# EAGLE design orb-se (EAGLE 6.5.0)
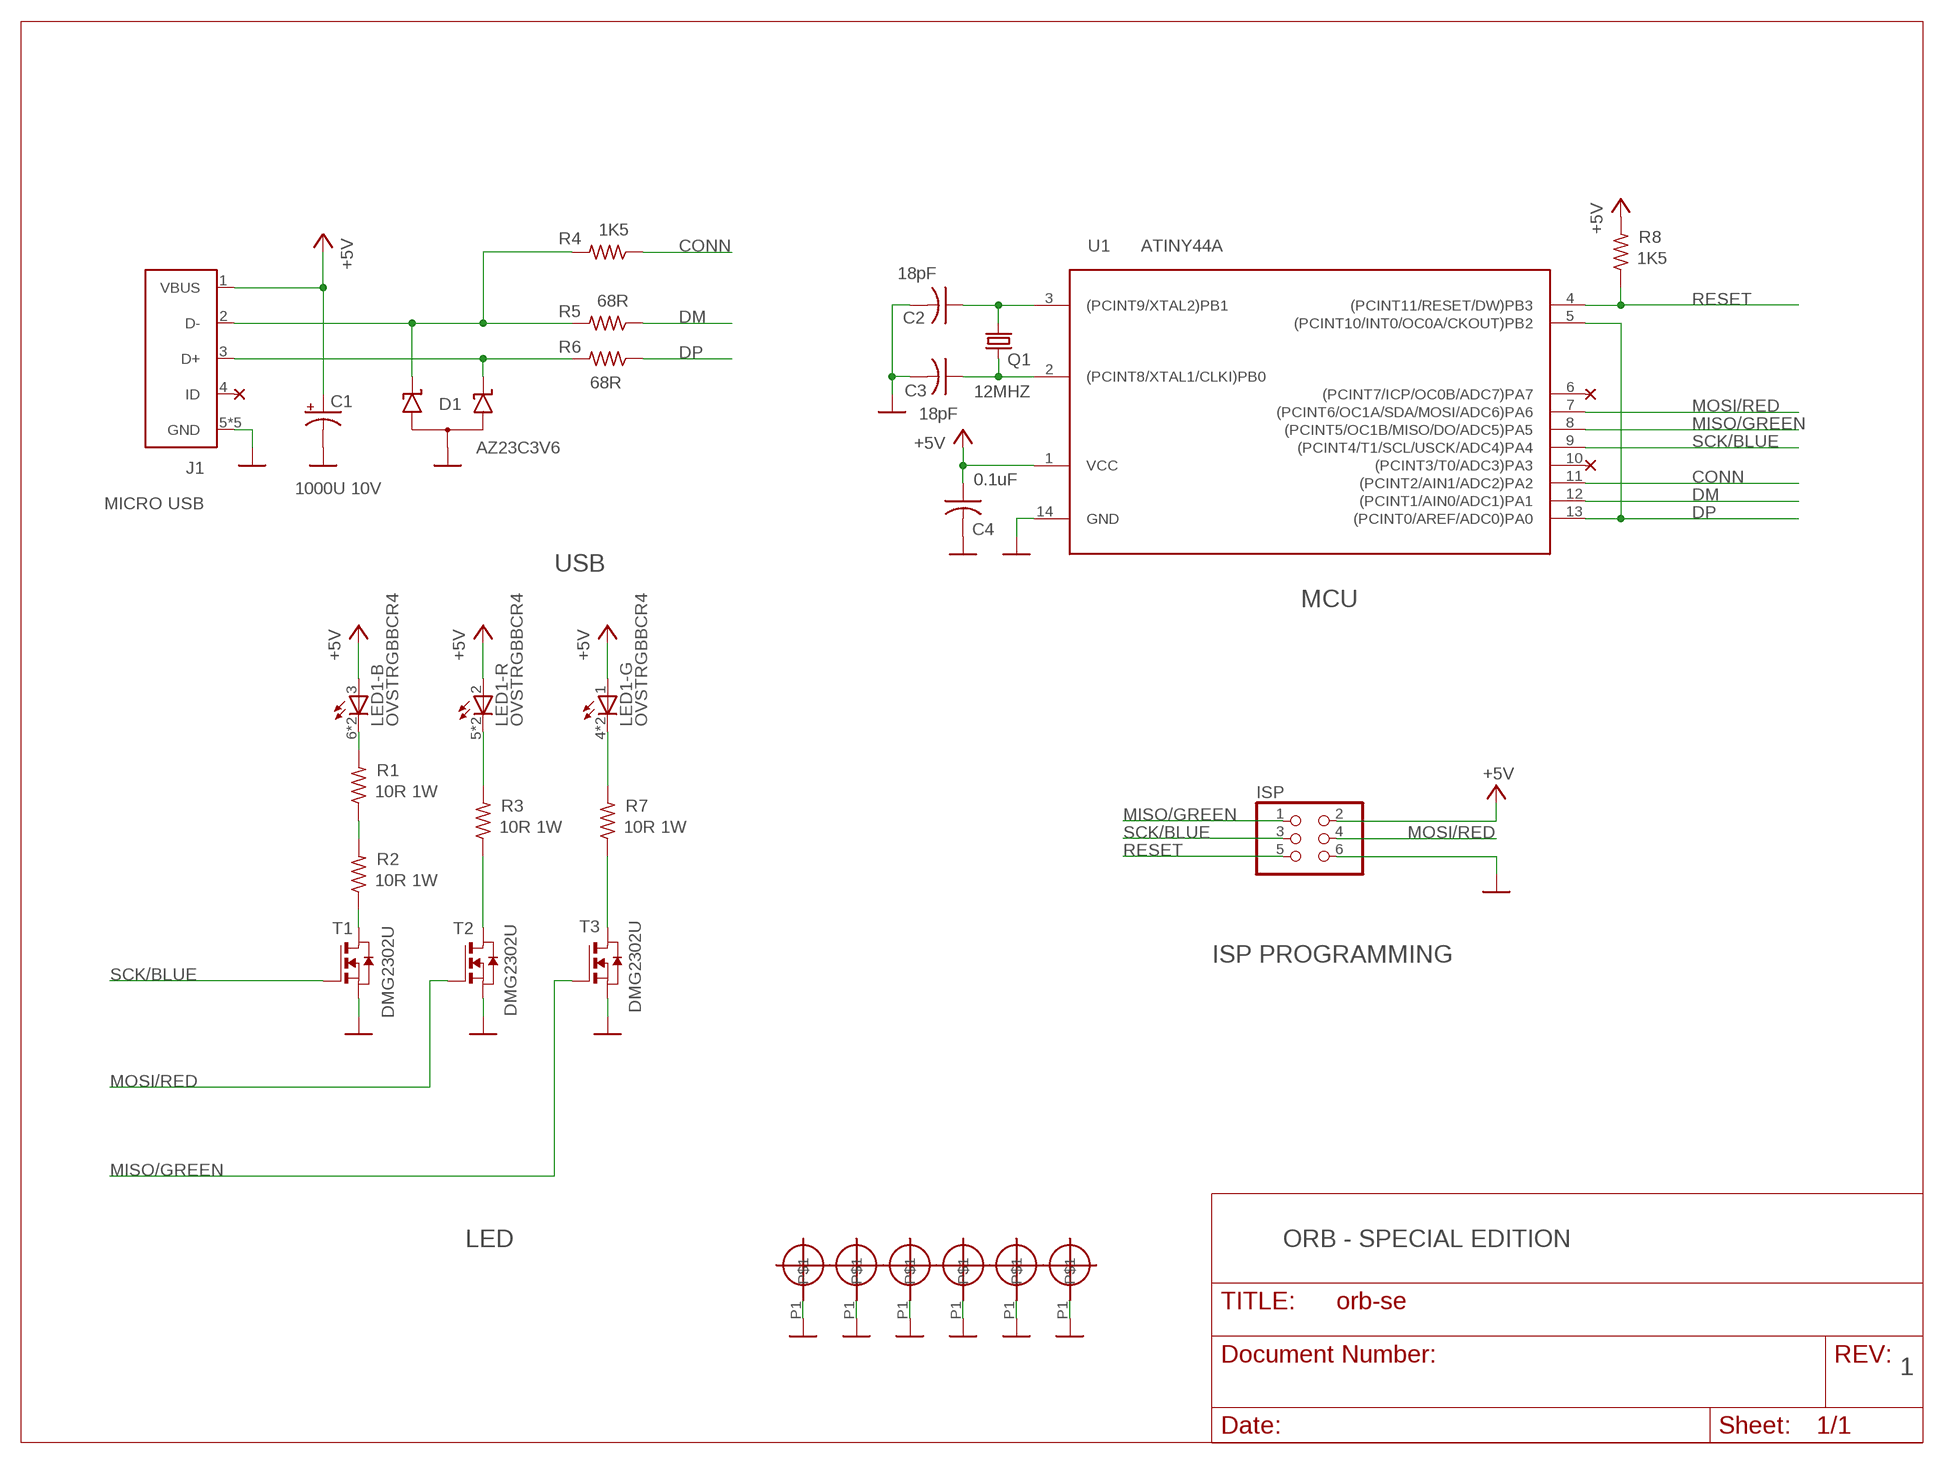
[diagram p0: schematic, sheet 1]

## Parts
C1  1000U 10V  CPOL-US153CLV-1010  [153CLV-1010]
C2  18pF  C-USC0805  [C0805]
C3  18pF  C-USC0805  [C0805]
C4  0.1uF  C-USC0805  [C0805]
D1  AZ23C3V6  [SOT23]
ISP  PINHD-2X3  [2X03]
J1  MICRO USB  USB  [USB-MICRO]
LED1  OVSTRGBBCR4  [OVSTRGBBCR4]
MH$1  MOUNTING_HOLE  [MOUNTING_HOLE]
MH$2  MOUNTING_HOLE  [MOUNTING_HOLE]
MH$3  MOUNTING_HOLE  [MOUNTING_HOLE]
MH$4  MOUNTING_HOLE  [MOUNTING_HOLE]
MH$5  MOUNTING_HOLE  [MOUNTING_HOLE]
MH$6  MOUNTING_HOLE  [MOUNTING_HOLE]
Q1  12MHZ  CRYSTAL  [CRYSTAL]
R1  10R 1W  R-US_R2512W  [R2512W]
R2  10R 1W  R-US_R2512W  [R2512W]
R3  10R 1W  R-US_R2512W  [R2512W]
R4  1K5  R-US_R0805  [R0805]
R5  68R  R-US_R0805  [R0805]
R6  68R  R-US_R0805  [R0805]
R7  10R 1W  R-US_R2512W  [R2512W]
R8  1K5  R-US_R0805  [R0805]
T1  DMG2302U  NMOSSOT23  [SOT-23]
T2  DMG2302U  NMOSSOT23  [SOT-23]
T3  DMG2302U  NMOSSOT23  [SOT-23]
U1  ATINY44A  TINY24/44/84-SSU  [SOIC14]

## Nets
+5V: C1.+ C4.1 ISP.2 J1.1(VBUS) LED1.1(-G:A) LED1.2(-R:A) LED1.3(-B:A) R8.2 U1.1(VCC)
CONN: R4.1 U1.11((PCINT2/AIN1/ADC2)PA2)
DM: R5.1 U1.12((PCINT1/AIN0/ADC1)PA1)
DP: R6.1 U1.5((PCINT10/INT0/OC0A/CKOUT)PB2) U1.13((PCINT0/AREF/ADC0)PA0)
GND: C1.- C2.2 C3.2 C4.2 D1.3(AA) ISP.6 J1.5(GND) J1.G1(GND) J1.G2(GND) J1.G3(GND) J1.G4(GND) MH$1.P1 MH$2.P1 MH$3.P1 MH$4.P1 MH$5.P1 MH$6.P1 T1.2(S) T2.2(S) T3.2(S) U1.14(GND) ; supply symbol labelled AZ23C3V6
MISO/GREEN: ISP.1 T3.3(G) U1.8((PCINT5/OC1B/MISO/DO/ADC5)PA5)
MOSI/RED: ISP.4 T2.3(G) U1.7((PCINT6/OC1A/SDA/MOSI/ADC6)PA6)
N$1: C2.1 Q1.2 U1.3((PCINT9/XTAL2)PB1)
N$3: C3.1 Q1.1 U1.2((PCINT8/XTAL1/CLKI)PB0)
N$4: R1.1 R2.2
N$5: D1.1(K1) J1.2(D-) R4.2 R5.2
N$6: D1.2(K2) J1.3(D+) R6.2
N$7: LED1.6(-B:C) LED1.6@1(-B:C) R1.2
N$8: LED1.5(-R:C) LED1.5@1(-R:C) R3.2
N$9: LED1.4(-G:C) LED1.4@1(-G:C) R7.2
N$13: R2.1 T1.1(D)
N$14: R3.1 T2.1(D)
N$15: R7.1 T3.1(D)
RESET: ISP.5 R8.1 U1.4((PCINT11/RESET/DW)PB3)
SCK/BLUE: ISP.3 T1.3(G) U1.9((PCINT4/T1/SCL/USCK/ADC4)PA4)
Unconnected: J1.4(ID) U1.6((PCINT7/ICP/OC0B/ADC7)PA7) U1.10((PCINT3/T0/ADC3)PA3)

## Notes on the sheet
- USB
- MCU
- ISP PROGRAMMING
- LED | ORB - SPECIAL EDITION
- 1

## Library data of the parts
C1 = orb-se:CPOL-US: POLARIZED CAPACITOR, American symbol
C2-C4 = orb-se:C-US: CAPACITOR, American symbol
D1 = orb-se:AZ23C3V6: Silicon Schottky Diodes General-purpose diode for high-speed switching
ISP = orb-se:PINHD-2X3
J1 = orb-se:USB
LED1 = orb-se:OVSTRGBBCR4: Full Color PLCC6 LED OVSTRGBBCR8 Source: www.optekinc.com .. ovstrgbbcr8.pdf
MH$1-MH$6 = orb-se:MOUNTING_HOLE
Q1 = orb-se:CRYSTAL: SMD CRYSTAL Source: www.ecsxtal.com .. Crystal 3.6864MHz CSM_7X_DU.PDF; OC_FARNELL: unknown; OC_NEWARK: unknown
R1-R8 = orb-se:R-US_: RESISTOR, American symbol
T1-T3 = orb-se:NMOSSOT23: MOS FET; OC_FARNELL: unknown; OC_NEWARK: unknown
U1 = orb-se:TINY24/44/84

## Net classes
1 power: width 0.254 mm

## Board
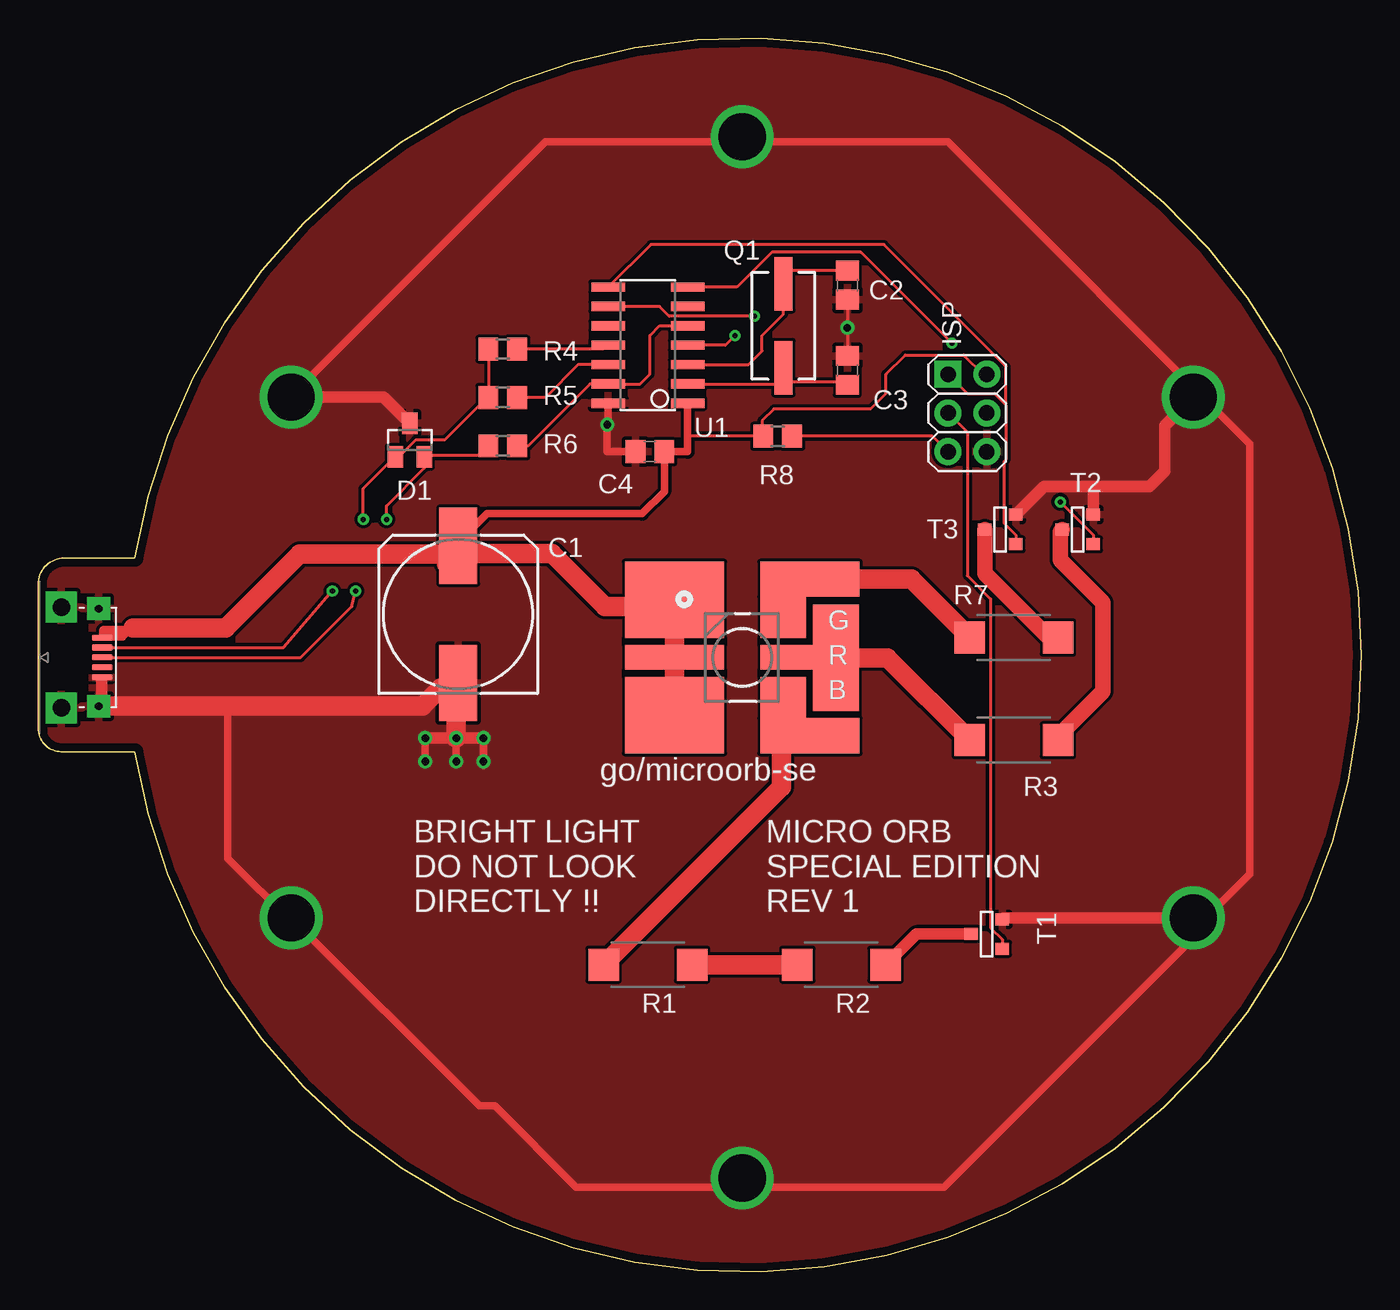
[diagram p1: board, top side]
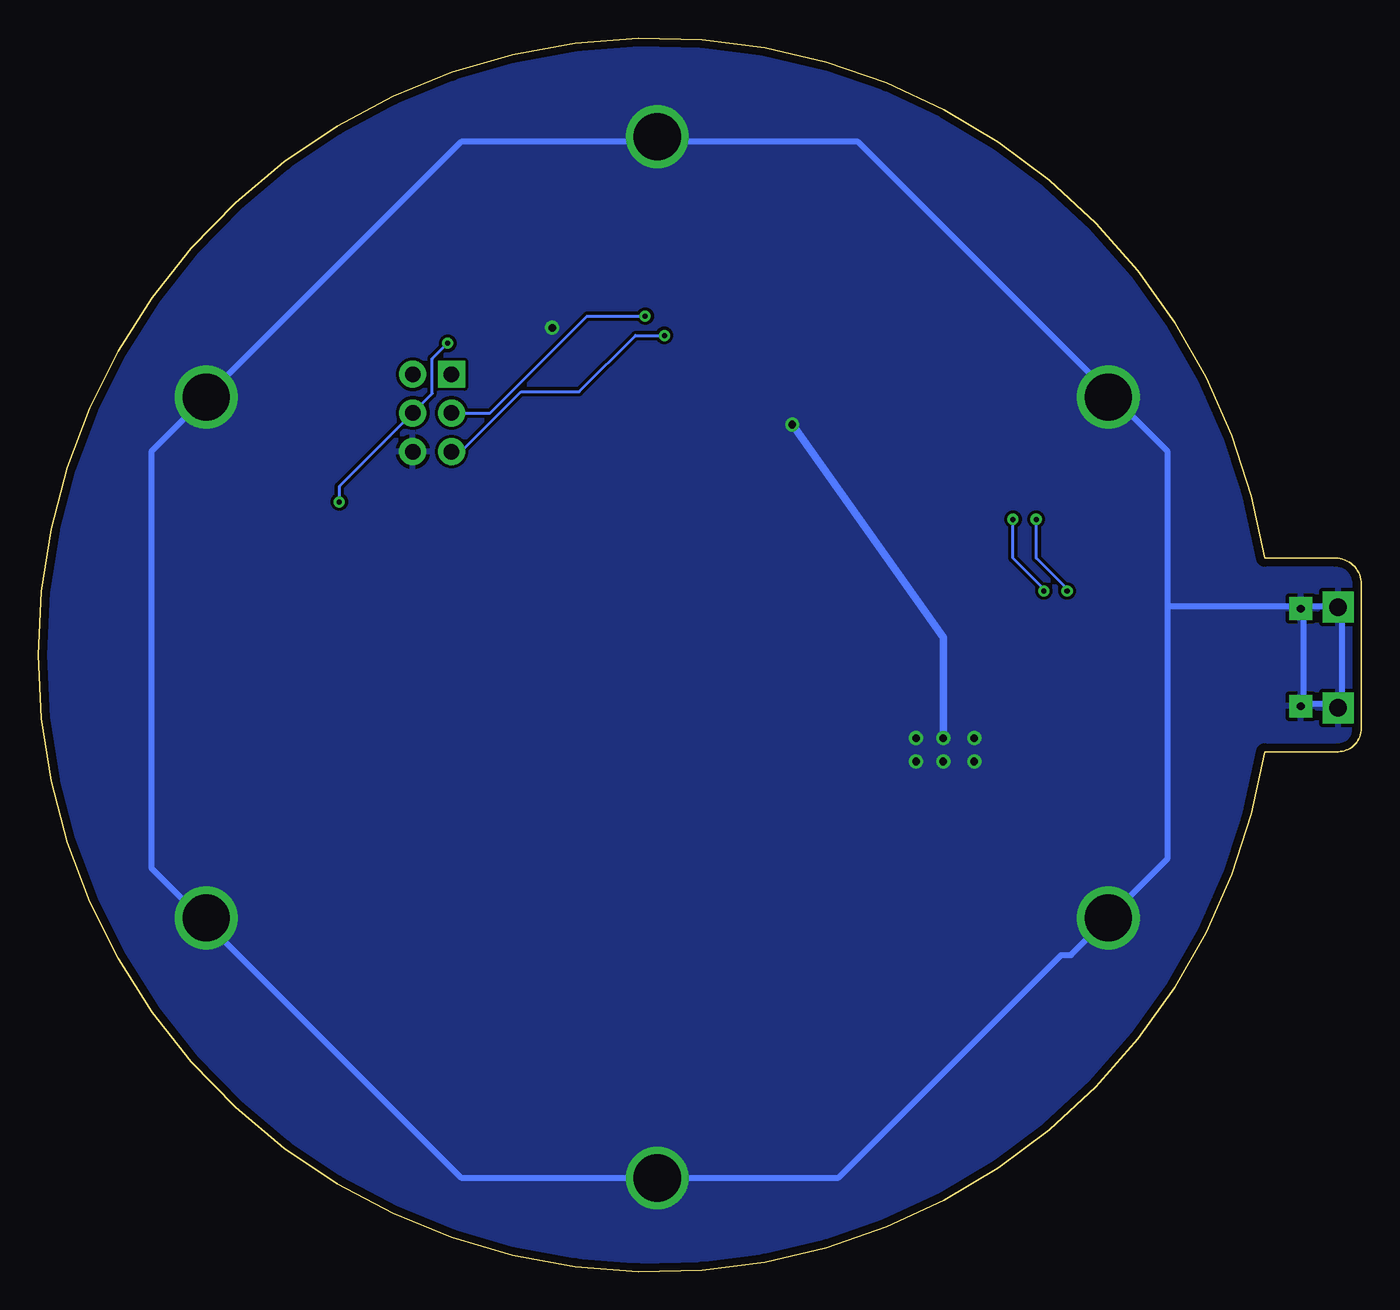
[diagram p2: board, bottom side, seen from below]

Size 86.81 x 80.93 mm. Coordinates in mm from the lower left corner, seen from the top.
Outline: 6.35,46.82 arc-342 6.35,34.12 1.53,34.12 arc-90 0,35.64 0,45.11 arc-90 1.71,46.82 6.35,46.82
Copper layers (1*16): Top 0.035mm / dielectric 1.5mm / Bottom 0.035mm
Design rules "default *": minimum track width 8mil, minimum drill 13mil, track to track 8mil, track to pad 8mil, pad to pad 8mil, via to via 8mil, smd to smd 0mil, copper to edge 20mil, drill to drill 8mil, minimum pad ring 7mil, minimum via ring 8mil, stop-mask expansion 4mil, vias tented up to drill 20mil, thermal gap 10mil

### Footprints (pad centres in the part's own frame; a part is rotated, then mirrored left to right if it is on the bottom)
153CLV-1010 = smd 5 x 2.5: + 4.5,0; - -4.5,0
C0805 = smd 1.3 x 1.5: 1 -0.95,0; 2 0.95,0
SOT23 = smd 1 x 1.4: 1 -0.95,-1.1; 2 0.95,-1.1; 3 0,1.1
2X03 = drill 1.016 pad 1.778 square: 1 -2.54,-1.27 | drill 1.016 pad 1.778: 2 -2.54,1.27; 3 0,-1.27; 4 0,1.27; 5 2.54,-1.27; 6 2.54,1.27
USB-MICRO = smd 0.4 x 1.35: 1 -1.3,2.675; 2 -0.65,2.675; 3 0,2.675; 4 0.65,2.675; 5 1.3,2.675 | drill 1.143 pad 2.032 square: G1 -3.3,0; G2 3.3,0 | drill 0.508 pad 1.5 square: G3 -3.2,2.45; G4 3.2,2.45
OVSTRGBBCR4 = smd 6.5 x 5: 1 -4.442,3.786; 3 -4.442,-3.786 | smd 6.5 x 1.6: 2 -4.442,0 | smd 3 x 5: 4 2.692,3.786; 6 2.692,-3.786 | smd 6.5 x 2.3: 4@1 4.442,5.136; 6@1 4.442,-5.136 | smd 5 x 1.6: 5 3.692,0 | smd 3 x 7: 5@1 6.15,-0.025
MOUNTING_HOLE = drill 3.1: P1 0,0
CRYSTAL = smd 3.5 x 1.2: 1 -2.75,0; 2 2.75,0
R2512W = smd 2 x 2.1: 1 -2.896,0; 2 2.896,0
R0805 = smd 1.3 x 1.5: 1 -0.95,0; 2 0.95,0
SOT-23 = smd 0.787 x 0.889: 1 0.025,-1.016; 2 -0.94,1.016; 3 0.991,1.016
SOIC14 = smd 0.61 x 2.21: 1 -3.81,-2.603; 2 -2.54,-2.603; 3 -1.27,-2.603; 4 0,-2.603; 5 1.27,-2.603; 6 2.54,-2.603; 7 3.81,-2.603; 8 3.81,2.603; 9 2.54,2.603; 10 1.27,2.603; 11 0,2.603; 12 -1.27,2.603; 13 -2.54,2.603; 14 -3.81,2.603

### Placement (x,y rotation side)
C1  27.56,43.13 90 top
C2  53.09,64.72 270 top
C3  53.09,59.13 90 top
C4  40.13,53.8 180 top
D1  24.38,54.56 0 top
ISP  60.96,56.34 270 top
J1  1.52,40.3 270 top
LED1  46.19,40.3 0 top
MH$1  75.78,23.22 0 top
MH$2  46.19,74.47 0 top
MH$3  75.78,57.38 0 top
MH$4  16.6,57.38 0 top
MH$5  46.19,6.14 0 top
MH$6  16.6,23.22 0 top
Q1  48.89,62.06 90 top
R1  40,20.15 180 top
R2  52.7,20.15 180 top
R3  64.01,34.88 180 top
R4  30.48,60.53 180 top
R5  30.48,57.36 180 top
R6  30.48,54.18 180 top
R7  64.01,41.61 180 top
R8  48.51,54.82 180 top
T1  62.23,22.18 270 top
T2  68.2,48.72 270 top
T3  63.12,48.72 270 top
U1  40,60.79 90 top

### Tracks (layer width: path | path; a pad name or v marks a point on that pad's centre or on a via)
+5V
  Top 0.203: 27.69,47.96 27.69,47.7 C1.+ | R8.2 42.61,54.82 42.61,55.07 | ISP.2 61.98,58.88 60.71,60.15 56.9,60.15 55.63,58.88 55.63,57.61 54.61,56.59 48.26,56.59 47.5,55.83 47.5,54.88 R8.2 | 47.62,54.82 R8.2 | LED1.1 41.78,44.15 41.78,43.64 | J1.1 4.2,41.69 4.32,41.81
  Top 0.406: J1.1 5.58,41.6 6.22,42.24
  Top 0.508: 27.69,47.96 29.46,49.74 39.62,49.74 41.08,51.19 C4.1 42.61,53.8 42.61,55.07 U1.1
  Top 0.61: 5.77,42.07 4.32,42.07 4.32,41.81
  Top 1.27: 6.22,42.24 12.32,42.24 17.14,47.07 26.92,47.07 26.8,46.43 C1.+ 27.33,47.63 27.33,47.12 33.7,47.13 37.19,43.64 41.78,43.64 42.16,43.64 41.75,43.22 LED1.3 LED1.2
CONN
  Top 0.203: R4.1 37.08,60.53 37.34,60.79 U1.11
DM
  Top 0.203: U1.12 35.43,59.52 33.27,57.36 R5.1
DP
  Top 0.203: R6.1 32.13,54.18 36.2,58.25 U1.13 39.5,58.25 40.13,58.88 40.13,61.42 40.77,62.06 U1.5 41.78,62.06
GND  (via drill 0.51)
  Top 0.203: C2.2 v53.09,61.93 C3.2 | C4.2 39.37,53.8 | J1.5 4.2,38.93 4.32,38.81
  Top 0.406: J1.5 3.97,38.78 J1.G4
  Top 0.508: U1.14 37.4,55.58 37.34,55.52 37.34,53.8 C4.2 39.12,53.8 | 39.37,53.8 39.37,53.55 | 16.51,57.36 33.27,74.12 59.69,74.12 79.5,54.31 79.5,26.11 75.95,22.56 75.95,22.05 59.44,5.54 35.31,5.54 29.97,10.87 28.96,10.87 16.51,23.32 | 16.76,22.81 12.45,27.13 12.45,37.1 12.45,37.29 | v25.4,35 v25.4,33.48 | v27.43,35 v27.43,33.48 | 29.21,34.75 29.21,33.23 | 4.32,38.81 4.32,37.04
  Top 0.762: v25.4,35 v27.43,35 v29.21,35 | MH$4.P1 22.67,57.38 D1.3 | MH$1.P1 63.35,23.22 T1.2 | MH$3.P1 73.91,55.51 73.91,52.53 72.9,51.51 69.34,51.51 | 69.34,51.51 65.99,51.51 T3.2 | T2.2 69.22,51.39 69.34,51.51
  Top 1.27: J1.G4 12.45,37.1 25.21,37.1 26.42,38.31 27.43,38.24 | 27.43,38.24 C1.- | v27.43,35 27.43,38.24 | 27.43,38.24 27.43,39.07
  Bottom 0.406: 12.7,43.64 12.7,27.13 19.05,20.78 19.69,20.78 34.29,6.18 59.05,6.18 79.38,26.5 79.38,53.8 59.05,74.12 33.02,74.12 12.7,53.8 12.7,43.64 | 3.81,43.64 3.81,37.29 1.27,37.29 1.27,43.64 12.7,43.64
  Bottom 0.508: v27.43,35 27.43,41.61 v37.34,55.58
  other vias: 29.21,33.48
  pour Bottom: -2.54,84.28 96.52,84.28 96.52,-4.62 -2.54,-4.62
  pour Top: 5.59,76.15 13.72,84.28 76.96,84.28 95.5,65.74 95.5,15.19 78.49,-1.83 14.22,-1.83 0,12.4 0,69.8 2.29,74.63 3.81,75.14
MISO/GREEN
  Top 0.203: ISP.1 60.96,57.61 62.74,57.61 63.44,56.91 | T3.3 64.13,48.34 63.37,49.1 63.37,53.17 63.5,53.29 63.5,56.85 63.44,56.91 | 63.44,56.91 63.5,56.98 63.5,59.39 55.5,67.39 40.2,67.39 U1.8
MOSI/RED  (via drill 0.33)
  Top 0.203: v67.06,50.5 69.22,48.34 69.22,47.83 T2.3 | U1.7 45.85,64.6 48.13,66.88 53.97,66.88 v59.94,60.91
  Bottom 0.203: v67.06,50.5 67.06,51.51 ISP.4 60.96,57.61 60.96,59.9 v59.94,60.91
N$1
  Top 0.203: 49.34,63.64 49.02,63.96 49.02,63.71 48.96,63.64 48.89,63.71 | 48.89,63.71 Q1.2 48.89,65.67 C2.1 | U1.3 46.61,59.52 47.5,60.4 47.5,61.42 48.89,62.82 48.89,63.71
N$3
  Top 0.203: U1.2 48.64,58.25 48.77,58.37 | 48.77,58.37 49.02,58.63 49.02,59.26 Q1.1 | C3.1 53.02,58.12 52.77,58.37 48.77,58.37
N$4
  Top 1.27: R1.1 R2.2
N$5  (via drill 0.33)
  Top 0.203: J1.2 16.11,40.95 v19.3,44.66 | D1.1 23.5,53.55 23.75,53.55 24.77,54.56 26.67,54.56 29.46,57.36 R5.2 29.59,57.36 29.59,60.53 R4.2 | 23.37,53.42 D1.1 | v21.34,49.36 21.34,51.36 D1.1
  Bottom 0.203: v19.3,44.66 19.3,44.78 21.34,46.82 v21.34,49.36
N$6  (via drill 0.33)
  Top 0.203: J1.3 17.23,40.3 20.57,43.64 v20.83,44.66 | D1.2 25.4,53.55 28.83,53.55 29.46,54.18 R6.2 | 25.27,53.42 D1.2 | v22.86,49.36 22.86,50.24 25.33,52.72 D1.2
  Bottom 0.203: v20.83,44.66 20.83,44.78 22.86,46.82 v22.86,49.36
N$7
  Top 0.406: 48.77,37.29 48.88,37.29 LED1.6
  Top 1.27: R1.2 48.77,31.8 48.77,37.29
N$8
  Top 1.27: LED1.5@1 55.71,40.28 R3.2
N$9
  Top 1.27: LED1.4@1 57.28,45.44 R7.2
N$13
  Top 0.762: T1.1 57.61,22.15 R2.1
N$14
  Top 1.016: T2.1 67.06,48.57 67.06,46.69 69.85,43.89 69.85,38.05 66.9,35.11 R3.1
N$15
  Top 1.016: T3.1 62.1,45.8 66.29,41.61 R7.1
RESET  (via drill 0.33)
  Top 0.203: 42.04,60.79 U1.4 45.09,60.79 v45.72,61.42 | 49.4,54.82 R8.1 58.67,54.82 ISP.5
  Bottom 0.203: v45.72,61.42 47.62,61.42 51.31,57.74 55.12,57.74 59.05,53.8 ISP.5
SCK/BLUE  (via drill 0.33)
  Top 0.203: T1.3 63.25,21.8 62.48,22.56 62.48,44.15 60.96,45.67 60.96,55.07 ISP.3 | U1.9 40.77,63.33 41.4,62.69 v46.99,62.69
  Bottom 0.203: v46.99,62.69 50.8,62.69 57.15,56.34 ISP.3

### Text on the board
tPlace: G | R | B | go/microorb-se | BRIGHT LIGHT / DO NOT LOOK / DIRECTLY !! | MICRO ORB / SPECIAL EDITION / REV 1